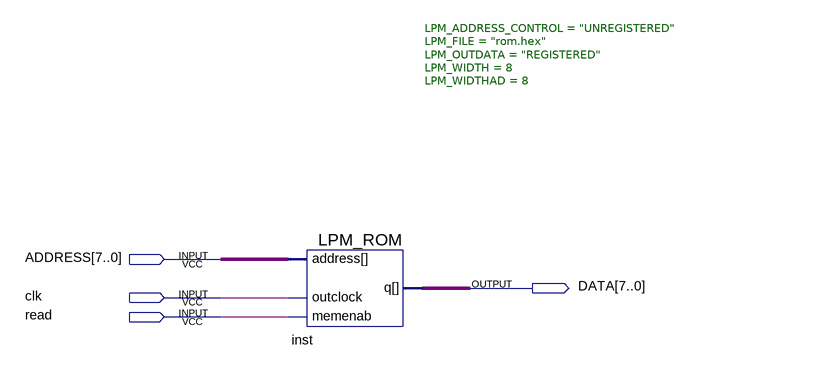
[diagram p0: schematic sheet]
// Quartus schematic ROM.bdf as structural Verilog: 1 symbols, 4 pins
module ROM (
  input  [7:0] ADDRESS,
  input  clk,
  input  read,
  output [7:0] DATA
);

  LPM_ROM #(.LPM_ADDRESS_CONTROL("UNREGISTERED"), .LPM_FILE("rom.hex"), .LPM_OUTDATA("REGISTERED"), .LPM_WIDTH(8), .LPM_WIDTHAD(8)) inst (
    .address(ADDRESS), .outclock(clk), .memenab(read), .q(DATA));
endmodule
